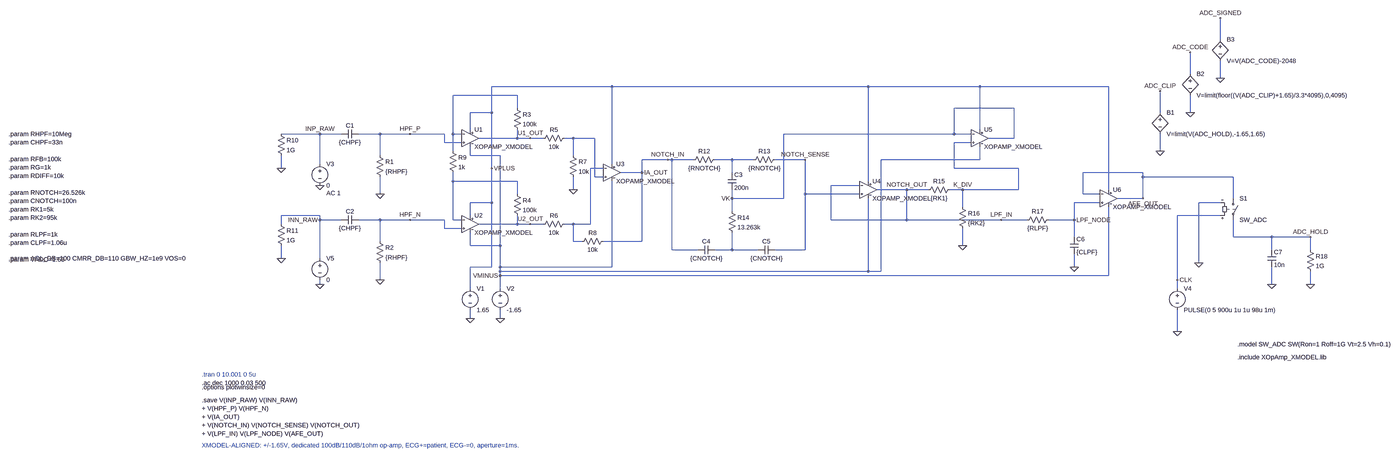
[diagram p0: schematic FULL_AFE_AC_TOTAL.asc, whole sheet]
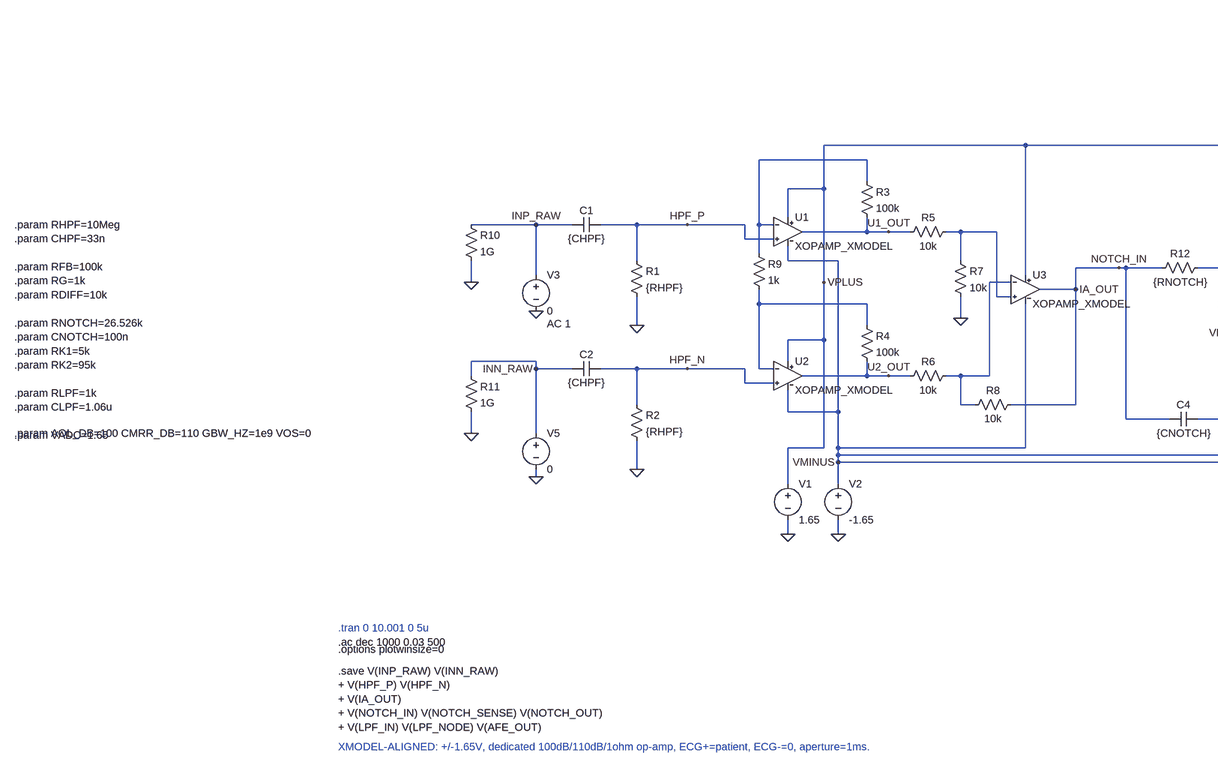
[diagram p1: schematic FULL_AFE_AC_TOTAL.asc, part, row 1 of 1, column 1 of 2]
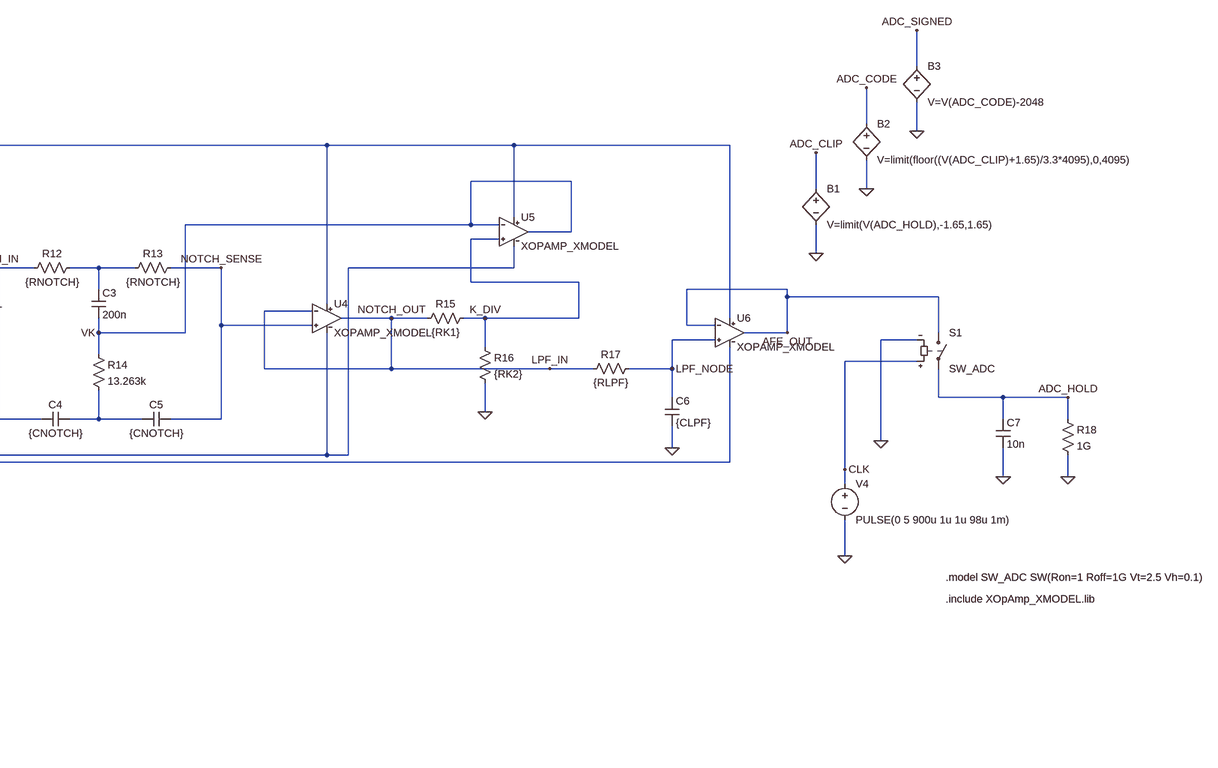
[diagram p2: schematic FULL_AFE_AC_TOTAL.asc, part, row 1 of 1, column 2 of 2]
FULL_AFE_AC_TOTAL.asc, the LTspice schematic file:
Version 4.1
SHEET 1 5556 1264
WIRE 3840 -304 3840 -384
WIRE 3728 -176 3728 -256
WIRE 3840 -160 3840 -224
WIRE 1568 -128 1120 -128
WIRE 2528 -128 1568 -128
WIRE 2944 -128 2528 -128
WIRE 3424 -128 2944 -128
WIRE 1216 -96 976 -96
WIRE 1216 -48 1216 -96
WIRE 3072 -48 2848 -48
WIRE 1120 -32 1120 -128
WIRE 1120 -32 1040 -32
WIRE 3616 -32 3616 -112
WIRE 3728 -32 3728 -96
WIRE 1040 32 1040 -32
WIRE 2944 32 2944 -128
WIRE 480 48 336 48
WIRE 560 48 480 48
WIRE 704 48 624 48
WIRE 816 48 704 48
WIRE 944 48 816 48
WIRE 976 48 976 -96
WIRE 1008 48 976 48
WIRE 2848 48 2848 -48
WIRE 2848 48 2208 48
WIRE 2912 48 2848 48
WIRE 1216 64 1216 32
WIRE 1216 64 1072 64
WIRE 1264 64 1216 64
WIRE 1312 64 1264 64
WIRE 1424 64 1392 64
WIRE 1504 64 1424 64
WIRE 3072 64 3072 -48
WIRE 3072 64 2976 64
WIRE 944 80 944 48
WIRE 1008 80 944 80
WIRE 2912 80 2848 80
WIRE 976 112 976 48
WIRE 3616 112 3616 48
WIRE 704 128 704 48
WIRE 1040 128 1040 96
WIRE 1152 128 1040 128
WIRE 1424 128 1424 64
WIRE 1776 144 1680 144
WIRE 1792 144 1776 144
WIRE 1872 144 1792 144
WIRE 2016 144 1952 144
WIRE 2096 144 2016 144
WIRE 2288 144 2176 144
WIRE 2944 144 2944 96
WIRE 2944 144 2576 144
WIRE 480 160 480 48
WIRE 1568 160 1568 -128
WIRE 336 176 336 128
WIRE 1120 176 1120 -32
WIRE 1536 176 1488 176
WIRE 2848 176 2848 80
WIRE 3088 176 2848 176
WIRE 1680 192 1680 144
WIRE 1680 192 1600 192
WIRE 2016 192 2016 144
WIRE 3552 192 3328 192
WIRE 1504 208 1504 64
WIRE 1536 208 1504 208
WIRE 3552 208 3552 192
WIRE 3888 208 3552 208
WIRE 976 224 976 192
WIRE 1216 224 976 224
WIRE 2528 224 2528 -128
WIRE 2496 240 2384 240
WIRE 1424 256 1424 208
WIRE 2672 256 2560 256
WIRE 2752 256 2672 256
WIRE 2880 256 2832 256
WIRE 3088 256 3088 176
WIRE 3088 256 2880 256
WIRE 3424 256 3424 -128
WIRE 704 272 704 208
WIRE 1216 272 1216 224
WIRE 2288 272 2288 144
WIRE 2496 272 2288 272
WIRE 3328 272 3328 192
WIRE 3392 272 3328 272
WIRE 2016 288 2016 256
WIRE 2208 288 2208 48
WIRE 2208 288 2016 288
WIRE 3552 288 3552 208
WIRE 3552 288 3456 288
WIRE 3888 288 3888 208
WIRE 1120 304 1120 176
WIRE 1120 304 1040 304
WIRE 3392 304 3296 304
WIRE 3840 304 3760 304
WIRE 2880 320 2880 256
WIRE 2016 336 2016 288
WIRE 480 352 336 352
WIRE 1040 352 1040 304
WIRE 3840 352 3680 352
WIRE 480 368 480 352
WIRE 560 368 480 368
WIRE 704 368 624 368
WIRE 816 368 704 368
WIRE 944 368 816 368
WIRE 976 368 976 224
WIRE 1008 368 976 368
WIRE 2384 368 2384 240
WIRE 2672 368 2672 256
WIRE 2672 368 2384 368
WIRE 3024 368 2672 368
WIRE 3120 368 3024 368
WIRE 3296 368 3296 304
WIRE 3296 368 3200 368
WIRE 336 384 336 352
WIRE 1216 384 1216 352
WIRE 1216 384 1072 384
WIRE 1264 384 1216 384
WIRE 1312 384 1264 384
WIRE 1424 384 1392 384
WIRE 1488 384 1488 176
WIRE 1488 384 1424 384
WIRE 944 400 944 368
WIRE 1008 400 944 400
WIRE 3296 432 3296 368
WIRE 3888 432 3888 368
WIRE 4032 432 3888 432
WIRE 4176 432 4032 432
WIRE 704 448 704 368
WIRE 1424 448 1424 384
WIRE 1456 448 1424 448
WIRE 1680 448 1680 192
WIRE 1680 448 1536 448
WIRE 1040 464 1040 416
WIRE 1152 464 1152 128
WIRE 1152 464 1040 464
WIRE 2880 464 2880 400
WIRE 1792 480 1792 144
WIRE 1888 480 1792 480
WIRE 2016 480 2016 416
WIRE 2016 480 1952 480
WIRE 2112 480 2016 480
WIRE 2288 480 2288 272
WIRE 2288 480 2176 480
WIRE 4032 480 4032 432
WIRE 4176 480 4176 432
WIRE 336 512 336 464
WIRE 480 512 480 368
WIRE 3760 528 3760 304
WIRE 1120 544 1120 304
WIRE 1120 544 1040 544
WIRE 1152 544 1152 464
WIRE 1568 544 1568 224
WIRE 1568 544 1152 544
WIRE 3296 544 3296 496
WIRE 1152 560 1152 544
WIRE 2528 560 2528 288
WIRE 2528 560 1152 560
WIRE 2576 560 2576 144
WIRE 2576 560 2528 560
WIRE 1152 576 1152 560
WIRE 3424 576 3424 320
WIRE 3424 576 1152 576
WIRE 704 592 704 528
WIRE 3680 592 3680 352
WIRE 480 608 480 592
WIRE 4032 608 4032 544
WIRE 4176 608 4176 560
WIRE 1040 624 1040 544
WIRE 1152 624 1152 576
WIRE 3680 624 3680 592
WIRE 1040 736 1040 704
WIRE 1152 736 1152 704
WIRE 3680 784 3680 704
FLAG 1040 736 0
FLAG 704 272 0
FLAG 704 592 0
FLAG 1152 736 0
FLAG 816 48 HPF_P
FLAG 816 368 HPF_N
FLAG 480 48 INP_RAW
FLAG 480 368 INN_RAW
FLAG 480 240 0
FLAG 480 608 0
FLAG 1152 576 VMINUS
FLAG 1424 256 0
FLAG 1264 64 U1_OUT
FLAG 1264 384 U2_OUT
FLAG 336 176 0
FLAG 336 512 0
FLAG 1776 144 NOTCH_IN
FLAG 2288 144 NOTCH_SENSE
FLAG 2672 256 NOTCH_OUT
FLAG 2880 464 0
FLAG 2880 256 K_DIV
FLAG 1120 176 VPLUS
FLAG 2016 288 VK
FLAG 3296 544 0
FLAG 3024 368 LPF_IN
FLAG 3296 368 LPF_NODE
FLAG 1680 192 IA_OUT
FLAG 3552 288 AFE_OUT
FLAG 3616 112 0
FLAG 3616 -112 ADC_CLIP
FLAG 3728 -32 0
FLAG 3728 -256 ADC_CODE
FLAG 3840 -160 0
FLAG 3840 -384 ADC_SIGNED
FLAG 3680 784 0
FLAG 3680 592 CLK
FLAG 3760 528 0
FLAG 4032 608 0
FLAG 4176 608 0
FLAG 4176 432 ADC_HOLD
SYMBOL XOpAmp_XMODEL 1040 64 R0
SYMATTR InstName U1
SYMATTR SpiceLine PARAMS: AOL_DB={AOL_DB} CMRR_DB={CMRR_DB} GBW_HZ={GBW_HZ} VOS={+VOS}
SYMBOL voltage 1040 608 R0
WINDOW 123 0 0 Left 0
WINDOW 39 0 0 Left 0
SYMATTR InstName V1
SYMATTR Value 1.65
SYMBOL voltage 1152 608 R0
WINDOW 123 0 0 Left 0
WINDOW 39 0 0 Left 0
SYMATTR InstName V2
SYMATTR Value -1.65
SYMBOL voltage 480 496 R0
WINDOW 123 0 0 Left 0
WINDOW 39 0 0 Left 0
SYMATTR InstName V5
SYMATTR Value 0
SYMBOL cap 624 32 R90
WINDOW 0 0 32 VBottom 2
WINDOW 3 32 32 VTop 2
SYMATTR InstName C1
SYMATTR Value {CHPF}
SYMBOL res 688 112 R0
SYMATTR InstName R1
SYMATTR Value {RHPF}
SYMBOL cap 624 352 R90
WINDOW 0 0 32 VBottom 2
WINDOW 3 32 32 VTop 2
SYMATTR InstName C2
SYMATTR Value {CHPF}
SYMBOL res 688 432 R0
SYMATTR InstName R2
SYMATTR Value {RHPF}
SYMBOL XOpAmp_XMODEL 1040 384 R0
SYMATTR InstName U2
SYMATTR SpiceLine PARAMS: AOL_DB={AOL_DB} CMRR_DB={CMRR_DB} GBW_HZ={GBW_HZ} VOS={-VOS}
SYMBOL res 1200 -64 R0
SYMATTR InstName R3
SYMATTR Value 100k
SYMBOL res 1200 256 R0
SYMATTR InstName R4
SYMATTR Value 100k
SYMBOL XOpAmp_XMODEL 1568 192 R0
SYMATTR InstName U3
SYMATTR SpiceLine PARAMS: AOL_DB={AOL_DB} CMRR_DB={CMRR_DB} GBW_HZ={GBW_HZ} VOS={0}
SYMBOL res 1408 48 R90
WINDOW 0 0 56 VBottom 2
WINDOW 3 32 56 VTop 2
SYMATTR InstName R5
SYMATTR Value 10k
SYMBOL res 1408 368 R90
WINDOW 0 0 56 VBottom 2
WINDOW 3 32 56 VTop 2
SYMATTR InstName R6
SYMATTR Value 10k
SYMBOL res 1408 112 R0
SYMATTR InstName R7
SYMATTR Value 10k
SYMBOL res 1552 432 R90
WINDOW 0 0 56 VBottom 2
WINDOW 3 32 56 VTop 2
SYMATTR InstName R8
SYMATTR Value 10k
SYMBOL res 960 96 R0
SYMATTR InstName R9
SYMATTR Value 1k
SYMBOL voltage 480 144 R0
WINDOW 123 24 124 Left 2
WINDOW 39 0 0 Left 0
SYMATTR Value2 AC 1
SYMATTR InstName V3
SYMATTR Value 0
SYMBOL res 320 32 R0
SYMATTR InstName R10
SYMATTR Value 1G
SYMBOL res 320 368 R0
SYMATTR InstName R11
SYMATTR Value 1G
SYMBOL res 1968 128 R90
WINDOW 0 0 56 VBottom 2
WINDOW 3 32 56 VTop 2
SYMATTR InstName R12
SYMATTR Value {RNOTCH}
SYMBOL res 2192 128 R90
WINDOW 0 0 56 VBottom 2
WINDOW 3 32 56 VTop 2
SYMATTR InstName R13
SYMATTR Value {RNOTCH}
SYMBOL cap 2000 192 R0
SYMATTR InstName C3
SYMATTR Value 200n
SYMBOL cap 1952 464 R90
WINDOW 0 0 32 VBottom 2
WINDOW 3 32 32 VTop 2
SYMATTR InstName C4
SYMATTR Value {CNOTCH}
SYMBOL cap 2176 464 R90
WINDOW 0 0 32 VBottom 2
WINDOW 3 32 32 VTop 2
SYMATTR InstName C5
SYMATTR Value {CNOTCH}
SYMBOL res 2000 320 R0
SYMATTR InstName R14
SYMATTR Value 13.263k
SYMBOL XOpAmp_XMODEL 2528 256 R0
SYMATTR InstName U4
SYMATTR SpiceLine PARAMS: AOL_DB={AOL_DB} CMRR_DB={CMRR_DB} GBW_HZ={GBW_HZ} VOS={0}
SYMBOL res 2848 240 R90
WINDOW 0 0 56 VBottom 2
WINDOW 3 32 56 VTop 2
SYMATTR InstName R15
SYMATTR Value {RK1}
SYMBOL res 2864 304 R0
SYMATTR InstName R16
SYMATTR Value {RK2}
SYMBOL XOpAmp_XMODEL 2944 64 R0
SYMATTR InstName U5
SYMATTR SpiceLine PARAMS: AOL_DB={AOL_DB} CMRR_DB={CMRR_DB} GBW_HZ={GBW_HZ} VOS={0}
SYMBOL res 3216 352 R90
WINDOW 0 0 56 VBottom 2
WINDOW 3 32 56 VTop 2
SYMATTR InstName R17
SYMATTR Value {RLPF}
SYMBOL cap 3280 432 R0
SYMATTR InstName C6
SYMATTR Value {CLPF}
SYMBOL XOpAmp_XMODEL 3424 288 R0
SYMATTR InstName U6
SYMATTR SpiceLine PARAMS: AOL_DB={AOL_DB} CMRR_DB={CMRR_DB} GBW_HZ={GBW_HZ} VOS={0}
SYMBOL bv 3616 -48 R0
SYMATTR InstName B1
SYMATTR Value V=limit(V(ADC_HOLD),-1.65,1.65)
SYMBOL bv 3728 -192 R0
SYMATTR InstName B2
SYMATTR Value V=limit(floor((V(ADC_CLIP)+1.65)/3.3*4095),0,4095)
SYMBOL bv 3840 -320 R0
SYMATTR InstName B3
SYMATTR Value V=V(ADC_CODE)-2048
SYMBOL voltage 3680 608 R0
SYMATTR InstName V4
SYMATTR Value PULSE(0 5 900u 1u 1u 98u 1m)
SYMBOL sw 3888 272 R0
SYMATTR InstName S1
SYMATTR Value SW_ADC
SYMBOL cap 4016 480 R0
SYMATTR InstName C7
SYMATTR Value 10n
SYMBOL res 4160 464 R0
SYMATTR InstName R18
SYMATTR Value 1G
TEXT -680 48 Left 2 !.param RHPF=10Meg\n.param CHPF=33n\n \n.param RFB=100k\n.param RG=1k\n.param RDIFF=10k\n \n.param RNOTCH=26.526k\n.param CNOTCH=100n\n.param RK1=5k\n.param RK2=95k\n \n.param RLPF=1k\n.param CLPF=1.06u\n \n.param VADC=1.65
TEXT 40 944 Left 2 ;.tran 0 10.001 0 5u
TEXT 40 992 Left 2 !.options plotwinsize=0
TEXT 40 1040 Left 2 !.save V(INP_RAW) V(INN_RAW)\n+ V(HPF_P) V(HPF_N)\n+ V(IA_OUT)\n+ V(NOTCH_IN) V(NOTCH_SENSE) V(NOTCH_OUT)\n+ V(LPF_IN) V(LPF_NODE) V(AFE_OUT)
TEXT 40 1208 Left 2 ;XMODEL-ALIGNED: +/-1.65V, dedicated 100dB/110dB/1ohm op-amp, ECG+=patient, ECG-=0, aperture=1ms.
TEXT 3904 832 Left 2 !.model SW_ADC SW(Ron=1 Roff=1G Vt=2.5 Vh=0.1)
TEXT 3904 880 Left 2 !.include XOpAmp_XMODEL.lib
TEXT -680 512 Left 2 !.param AOL_DB=100 CMRR_DB=110 GBW_HZ=1e9 VOS=0
TEXT 40 976 Left 2 !.ac dec 1000 0.03 500

The netlist it stands for:
* FULL_AFE_AC_TOTAL.asc
X§U1 HPF_P N001 VPLUS VMINUS U1_OUT XOPAMP_XMODEL PARAMS: AOL_DB={AOL_DB} CMRR_DB={CMRR_DB} GBW_HZ={GBW_HZ} VOS={+VOS}  ; pins In+ In- V+ V- OUT
V1 VPLUS 0 1.65
V2 VMINUS 0 -1.65
V5 INN_RAW 0 0
C1 HPF_P INP_RAW {CHPF}
R1 HPF_P 0 {RHPF}
C2 HPF_N INN_RAW {CHPF}
R2 HPF_N 0 {RHPF}
X§U2 HPF_N N005 VPLUS VMINUS U2_OUT XOPAMP_XMODEL PARAMS: AOL_DB={AOL_DB} CMRR_DB={CMRR_DB} GBW_HZ={GBW_HZ} VOS={-VOS}  ; pins In+ In- V+ V- OUT
R3 N001 U1_OUT 100k
R4 N005 U2_OUT 100k
X§U3 N002 N004 VPLUS VMINUS IA_OUT XOPAMP_XMODEL PARAMS: AOL_DB={AOL_DB} CMRR_DB={CMRR_DB} GBW_HZ={GBW_HZ} VOS={0}  ; pins In+ In- V+ V- OUT
R5 N002 U1_OUT 10k
R6 N004 U2_OUT 10k
R7 N002 0 10k
R8 IA_OUT N004 10k
R9 N001 N005 1k
V3 INP_RAW 0 0 AC 1
R10 INP_RAW 0 1G
R11 INN_RAW 0 1G
R12 N003 IA_OUT {RNOTCH}
R13 NOTCH_SENSE N003 {RNOTCH}
C3 N003 VK 200n
C4 N006 IA_OUT {CNOTCH}
C5 NOTCH_SENSE N006 {CNOTCH}
R14 VK N006 13.263k
X§U4 NOTCH_SENSE LPF_IN VPLUS VMINUS LPF_IN XOPAMP_XMODEL PARAMS: AOL_DB={AOL_DB} CMRR_DB={CMRR_DB} GBW_HZ={GBW_HZ} VOS={0}  ; pins In+ In- V+ V- OUT
R15 K_DIV LPF_IN {RK1}
R16 K_DIV 0 {RK2}
X§U5 K_DIV VK VPLUS VMINUS VK XOPAMP_XMODEL PARAMS: AOL_DB={AOL_DB} CMRR_DB={CMRR_DB} GBW_HZ={GBW_HZ} VOS={0}  ; pins In+ In- V+ V- OUT
R17 LPF_NODE LPF_IN {RLPF}
C6 LPF_NODE 0 {CLPF}
X§U6 LPF_NODE AFE_OUT VPLUS VMINUS AFE_OUT XOPAMP_XMODEL PARAMS: AOL_DB={AOL_DB} CMRR_DB={CMRR_DB} GBW_HZ={GBW_HZ} VOS={0}  ; pins In+ In- V+ V- OUT
B1 ADC_CLIP 0 V=limit(V(ADC_HOLD),-1.65,1.65)
B2 ADC_CODE 0 V=limit(floor((V(ADC_CLIP)+1.65)/3.3*4095),0,4095)
B3 ADC_SIGNED 0 V=V(ADC_CODE)-2048
V4 CLK 0 PULSE(0 5 900u 1u 1u 98u 1m)
S1 AFE_OUT ADC_HOLD CLK 0 SW_ADC
C7 ADC_HOLD 0 10n
R18 ADC_HOLD 0 1G
.param RHPF=10Meg
.param CHPF=33n
.param RFB=100k
.param RG=1k
.param RDIFF=10k
.param RNOTCH=26.526k
.param CNOTCH=100n
.param RK1=5k
.param RK2=95k
.param RLPF=1k
.param CLPF=1.06u
.param VADC=1.65
* .tran 0 10.001 0 5u
.options plotwinsize=0
.save V(INP_RAW) V(INN_RAW)
+ V(HPF_P) V(HPF_N)
+ V(IA_OUT)
+ V(NOTCH_IN) V(NOTCH_SENSE) V(NOTCH_OUT)
+ V(LPF_IN) V(LPF_NODE) V(AFE_OUT)
* XMODEL-ALIGNED: +/-1.65V, dedicated 100dB/110dB/1ohm op-amp, ECG+=patient, ECG-=0, aperture=1ms.
.model SW_ADC SW(Ron=1 Roff=1G Vt=2.5 Vh=0.1)
.include XOpAmp_XMODEL.lib
.param AOL_DB=100 CMRR_DB=110 GBW_HZ=1e9 VOS=0
.ac dec 1000 0.03 500
.backanno
.end